# Altium schematic sheet 6_beacon_radio.schdoc: Beacon Radio
size A4; DrawnBy: Sara Vega Martinez; Revision: v0.1; SheetNumber: 6; SheetTotal: 6; DesignedBy: André M. P. Mattos
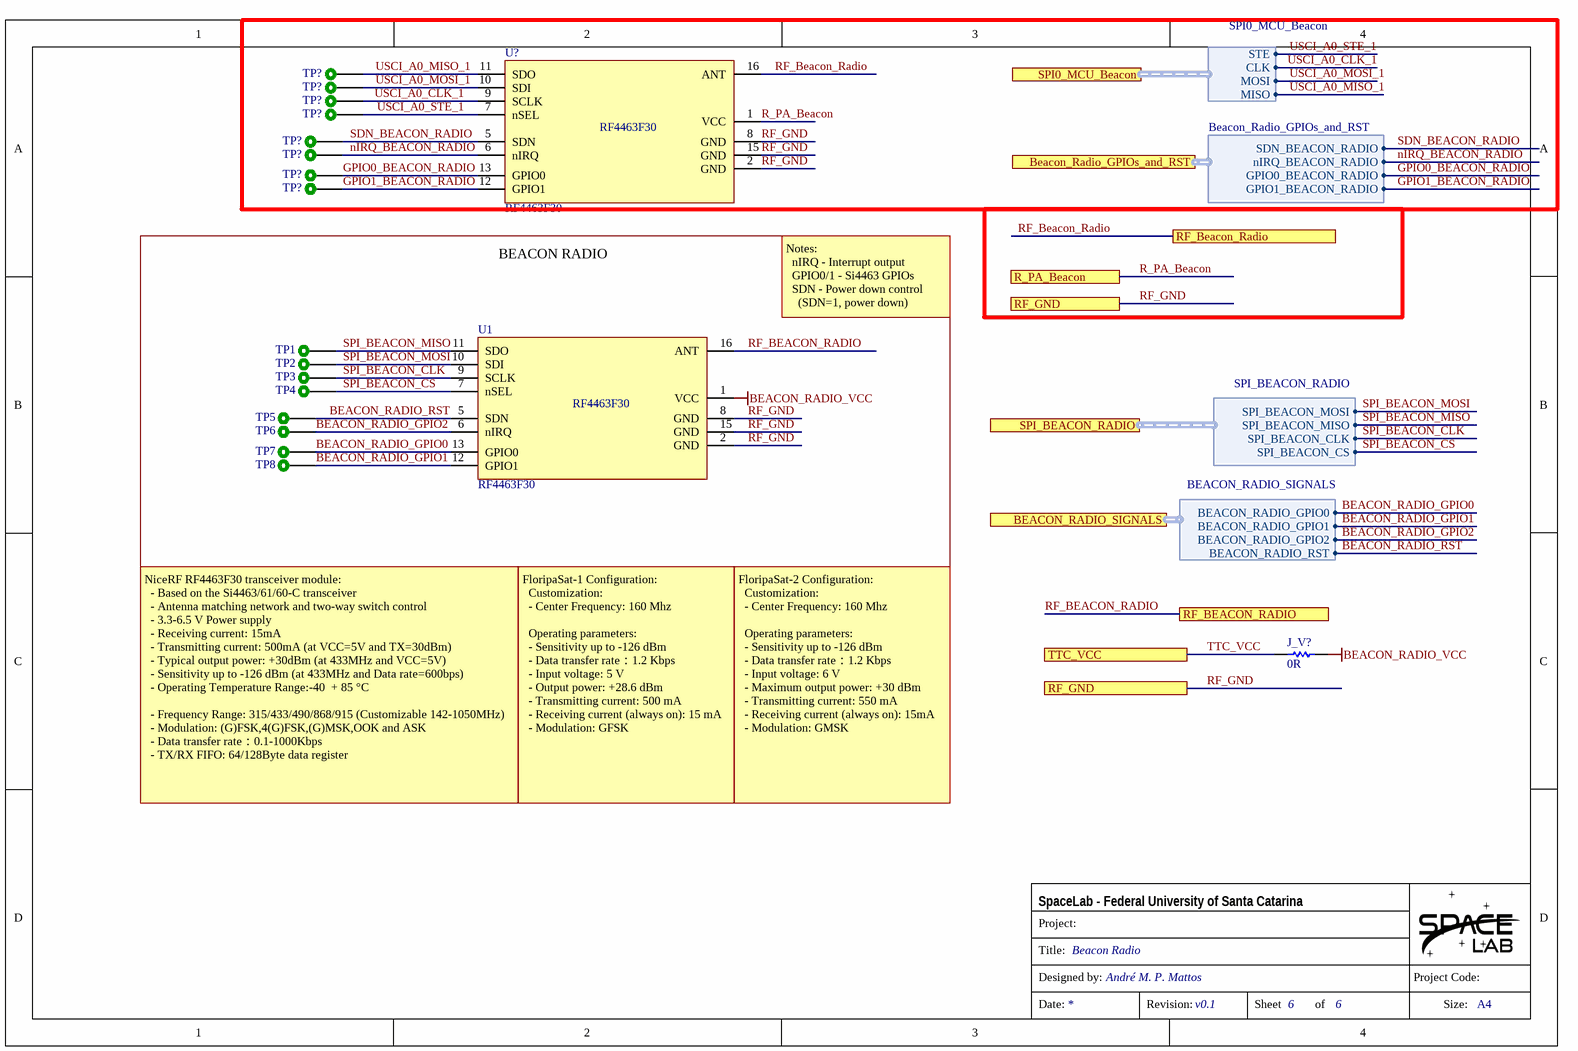
[diagram p0: 6_beacon_radio.schdoc]

## Parts
(Parts that share a designator on the sheet are numbered #1, #2 ... from top to bottom, then left to right.)
J_V?  0R  [0805]
TP1  TEST_POINT  [TEST_POINT]  (value not drawn)  (no BOM)
TP2  TEST_POINT  [TEST_POINT]  (value not drawn)  (no BOM)
TP3  TEST_POINT  [TEST_POINT]  (value not drawn)  (no BOM)
TP4  TEST_POINT  [TEST_POINT]  (value not drawn)  (no BOM)
TP5  TEST_POINT  [TEST_POINT]  (value not drawn)  (no BOM)
TP6  TEST_POINT  [TEST_POINT]  (value not drawn)  (no BOM)
TP7  TEST_POINT  [TEST_POINT]  (value not drawn)  (no BOM)
TP8  TEST_POINT  [TEST_POINT]  (value not drawn)  (no BOM)
TP?#1  TEST_POINT  [TEST_POINT]  (value not drawn)  (no BOM)
TP?#2  TEST_POINT  [TEST_POINT]  (value not drawn)  (no BOM)
TP?#3  TEST_POINT  [TEST_POINT]  (value not drawn)  (no BOM)
TP?#4  TEST_POINT  [TEST_POINT]  (value not drawn)  (no BOM)
TP?#5  TEST_POINT  [TEST_POINT]  (value not drawn)  (no BOM)
TP?#6  TEST_POINT  [TEST_POINT]  (value not drawn)  (no BOM)
TP?#7  TEST_POINT  [TEST_POINT]  (value not drawn)  (no BOM)
TP?#8  TEST_POINT  [TEST_POINT]  (value not drawn)  (no BOM)
U1  RF4463F30  [RF4463F30]
U?  RF4463F30  [RF4463F30]

## Blocks framed on the sheet
BEACON RADIO: TP1-TP8 U1

## Ports
Beacon_Radio_GPIOs_and_RST (harness Beacon_Radio_GPIOs_and_RST), BEACON_RADIO_SIGNALS (harness BEACON_RADIO_SIGNALS), R_PA_Beacon, RF_Beacon_Radio, RF_BEACON_RADIO, RF_GND, SPI0_MCU_Beacon (harness SPI0_MCU_Beacon), SPI_BEACON_RADIO (harness SPI_BEACON_RADIO), TTC_VCC

## Harnesses
SPI0_MCU_Beacon: CLK, MISO, MOSI, STE
Beacon_Radio_GPIOs_and_RST: GPIO0_BEACON_RADIO, GPIO1_BEACON_RADIO, nIRQ_BEACON_RADIO, SDN_BEACON_RADIO
SPI_BEACON_RADIO: SPI_BEACON_CLK, SPI_BEACON_MISO, SPI_BEACON_MOSI, SPI_BEACON_CS
BEACON_RADIO_SIGNALS: BEACON_RADIO_GPIO0, BEACON_RADIO_GPIO2, BEACON_RADIO_RST, BEACON_RADIO_GPIO1

## Nets
BEACON_RADIO_VCC: J_V?.1 U1.1(VCC)
BEACON_RADIO_GPIO0: TP7.1 U1.13(GPIO0) ; port BEACON_RADIO_SIGNALS.BEACON_RADIO_GPIO0
BEACON_RADIO_GPIO1: TP8.1 U1.12(GPIO1) ; port BEACON_RADIO_SIGNALS.BEACON_RADIO_GPIO1
BEACON_RADIO_GPIO2: TP6.1 U1.6(nIRQ) ; port BEACON_RADIO_SIGNALS.BEACON_RADIO_GPIO2
BEACON_RADIO_RST: TP5.1 U1.5(SDN) ; port BEACON_RADIO_SIGNALS.BEACON_RADIO_RST
GPIO0_BEACON_RADIO: TP?#7.1 U?.13(GPIO0) ; port Beacon_Radio_GPIOs_and_RST.GPIO0_BEACON_RADIO
GPIO1_BEACON_RADIO: TP?#8.1 U?.12(GPIO1) ; port Beacon_Radio_GPIOs_and_RST.GPIO1_BEACON_RADIO
nIRQ_BEACON_RADIO: TP?#6.1 U?.6(nIRQ) ; port Beacon_Radio_GPIOs_and_RST.nIRQ_BEACON_RADIO
R_PA_Beacon: U?.1(VCC) ; port R_PA_Beacon
RF_Beacon_Radio: U1.16(ANT) U?.16(ANT) ; port RF_Beacon_Radio, port RF_BEACON_RADIO
RF_GND: U1.2(GND) U1.8(GND) U1.15(GND) U?.2(GND) U?.8(GND) U?.15(GND) ; port RF_GND
SDN_BEACON_RADIO: TP?#5.1 U?.5(SDN) ; port Beacon_Radio_GPIOs_and_RST.SDN_BEACON_RADIO
SPI_BEACON_CLK: TP3.1 U1.9(SCLK) ; port SPI_BEACON_RADIO.SPI_BEACON_CLK
SPI_BEACON_CS: TP4.1 U1.7(nSEL) ; port SPI_BEACON_RADIO.SPI_BEACON_CS
SPI_BEACON_MISO: TP1.1 U1.11(SDO) ; port SPI_BEACON_RADIO.SPI_BEACON_MISO
SPI_BEACON_MOSI: TP2.1 U1.10(SDI) ; port SPI_BEACON_RADIO.SPI_BEACON_MOSI
TTC_VCC: J_V?.2 ; port TTC_VCC
USCI_A0_CLK_1: TP?#3.1 U?.9(SCLK) ; port SPI0_MCU_Beacon.CLK
USCI_A0_MISO_1: TP?#1.1 U?.11(SDO) ; port SPI0_MCU_Beacon.MISO
USCI_A0_MOSI_1: TP?#2.1 U?.10(SDI) ; port SPI0_MCU_Beacon.MOSI
USCI_A0_STE_1: TP?#4.1 U?.7(nSEL) ; port SPI0_MCU_Beacon.STE

## Notes on the sheet
- Notes:
  nIRQ - Interrupt output
  GPIO0/1 - Si4463 GPIOs
  SDN - Power down control
  (SDN=1, power down)
- NiceRF RF4463F30 transceiver module:
  - Based on the Si4463/61/60-C transceiver
  - Antenna matching network and two-way switch control
  - 3.3-6.5 V Power supply
  - Receiving current: 15mA
  - Transmitting current: 500mA (at VCC=5V and TX=30dBm)
  - Typical output power: +30dBm (at 433MHz and VCC=5V)
  - Sensitivity up to -126 dBm (at 433MHz and Data rate=600bps)
  - Operating Temperature Range:-40  + 85 °C
  - Frequency Range: 315/433/490/868/915 (Customizable 142-1050MHz)
  - Modulation: (G)FSK,4(G)FSK,(G)MSK,OOK and ASK
  - Data transfer rate：0.1-1000Kbps
  - TX/RX FIFO: 64/128Byte data register
- FloripaSat-1 Configuration:
  Customization:
  - Center Frequency: 160 Mhz
  Operating parameters:
  - Sensitivity up to -126 dBm
  - Data transfer rate：1.2 Kbps
  - Input voltage: 5 V
  - Output power: +28.6 dBm
  - Transmitting current: 500 mA
  - Receiving current (always on): 15 mA
  - Modulation: GFSK
- FloripaSat-2 Configuration:
  Customization:
  - Center Frequency: 160 Mhz
  Operating parameters:
  - Sensitivity up to -126 dBm
  - Data transfer rate：1.2 Kbps
  - Input voltage: 6 V
  - Maximum output power: +30 dBm
  - Transmitting current: 550 mA
  - Receiving current (always on): 15mA
  - Modulation: GMSK
- Project:
- SpaceLab - Federal University of Santa Catarina
- Title:
- Designed by:
- Project Code:
- Date:
- Revision:
- Sheet
- of
- Size:
- A4

## Library data of the parts
J_V? = R0R_JUMPER_1/16W_0805: RES 0R OHM 1/16W JUMPER 0805; Partnumber: CRCW08050000Z0EA; NCM: 8533.21.20
TP1-TP8 TP?#1-TP?#8 = TEST_POINT: Test point
U1 U? = RF4463F30: RF4463F30 High Power Wireless Transceiver Module; Partnumber: RF4463F30